# Altium project mod_x_cb.PrjPCB
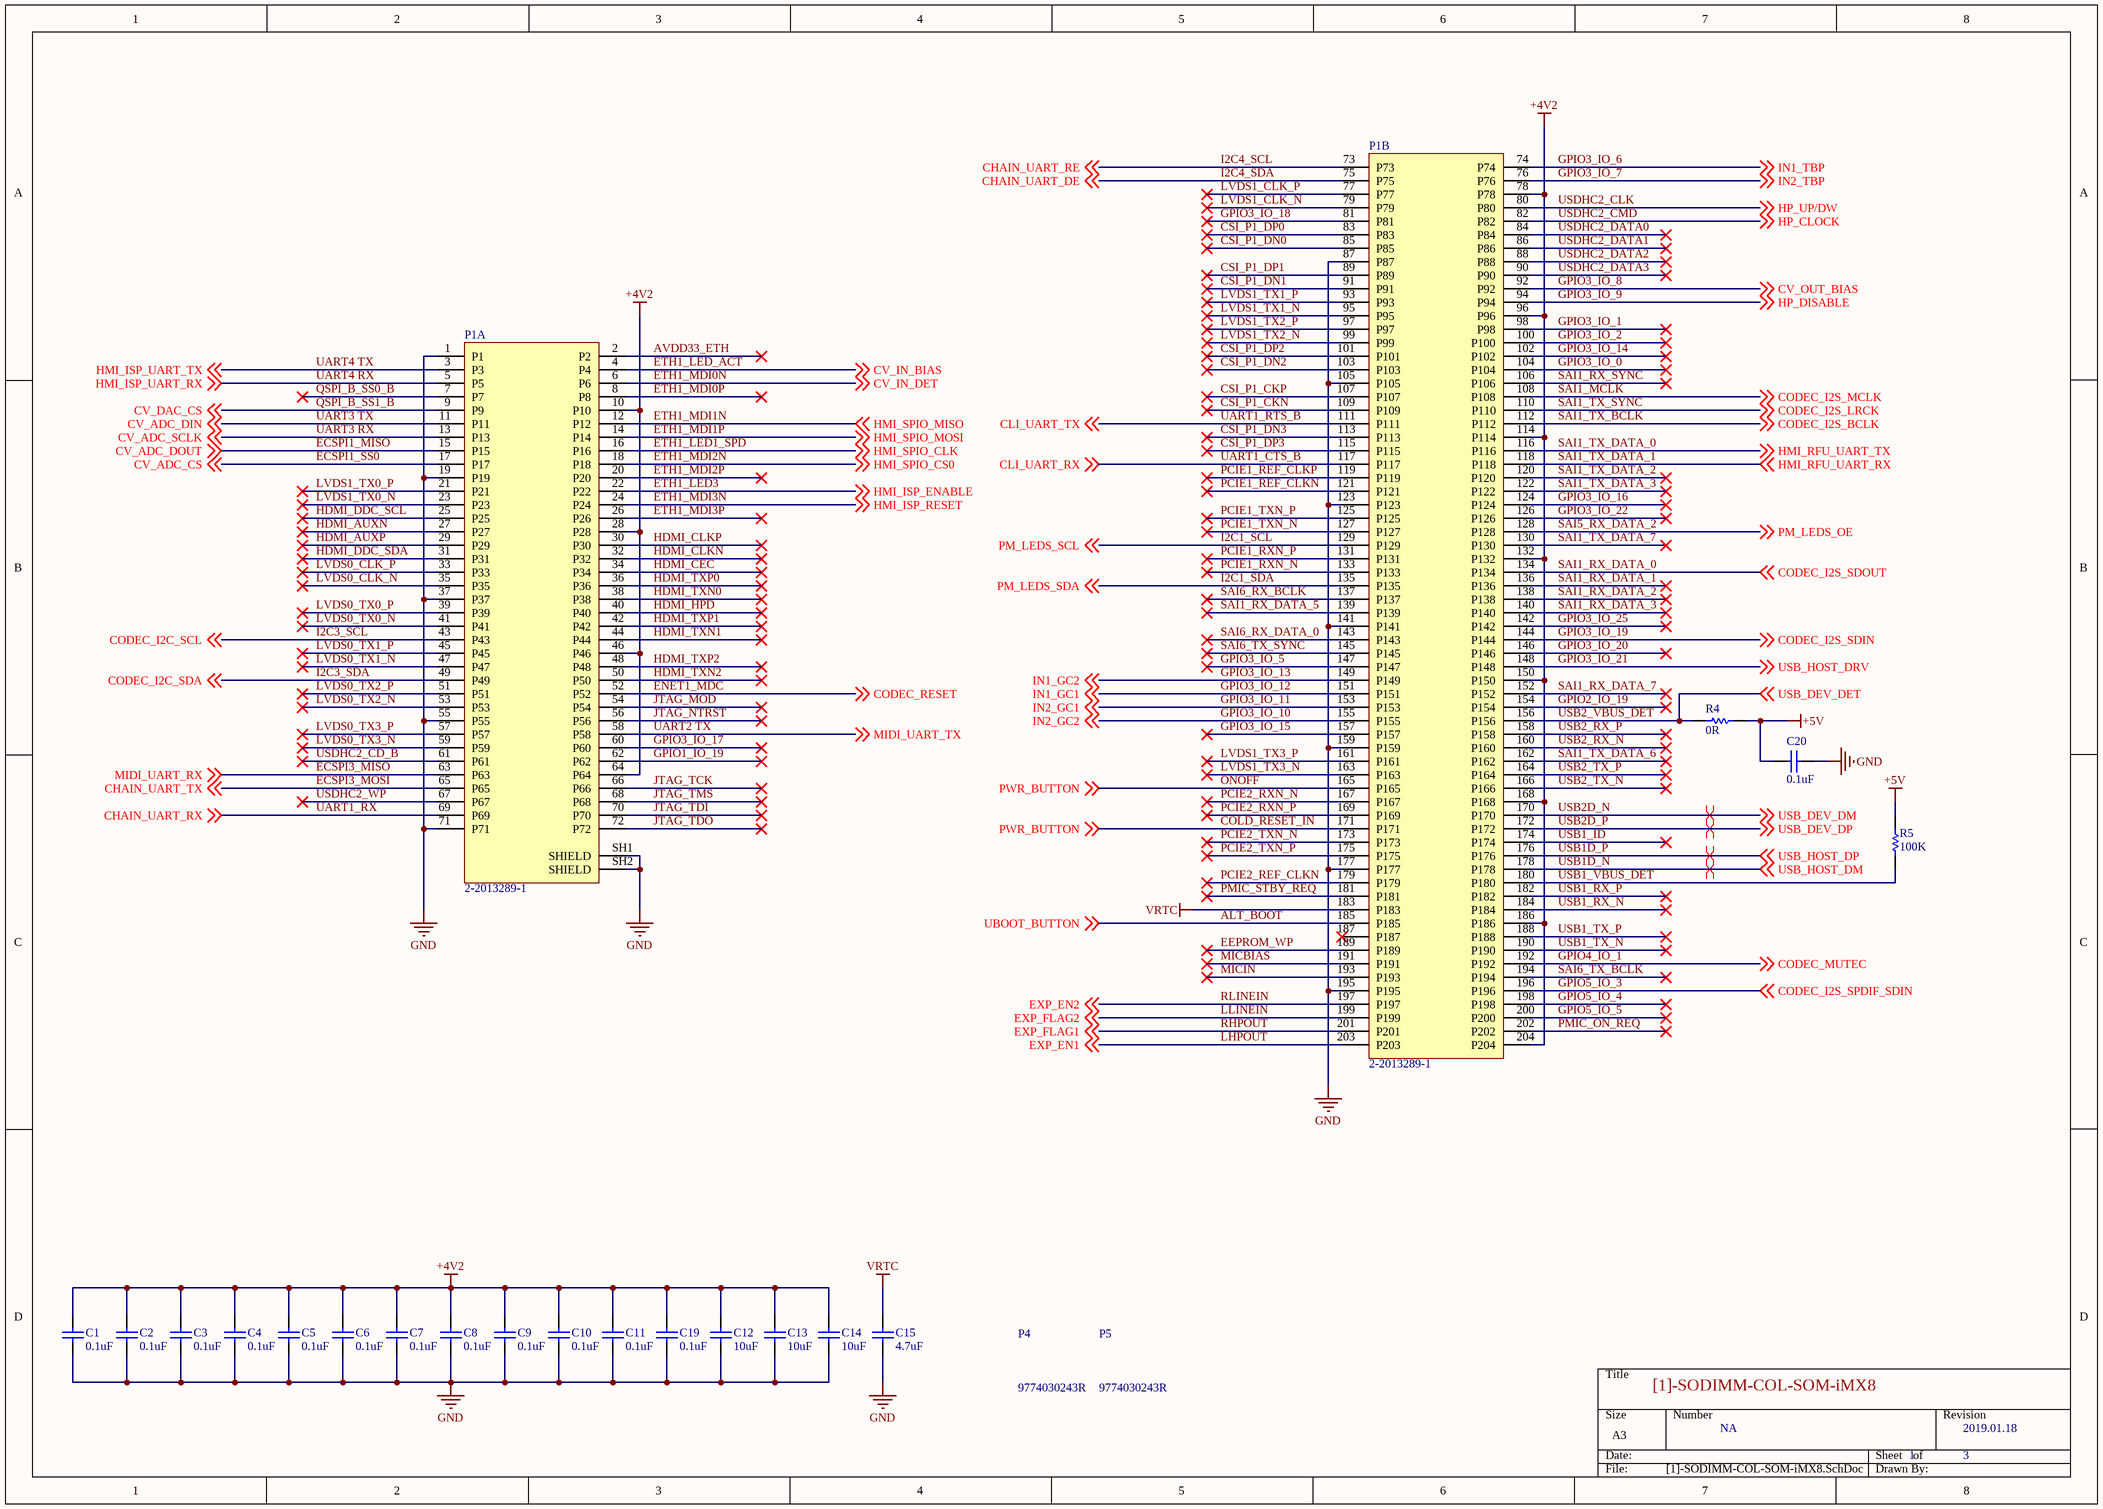
[diagram p0: [1]-SODIMM-COL-SOM-iMX8.SchDoc]
3 sheets, 33 parts. Net scope: global (net labels, ports and power ports of the same name join across sheets).
Board file: mod_duo_x_cb.PcbDoc
Sheets:
  [1]-SODIMM-COL-SOM-iMX8.SchDoc
  [2]-INTERFACE_CONNS.SchDoc
  [3]-DCDC-4V2.SchDoc

## Sheet [1]-SODIMM-COL-SOM-iMX8.SchDoc: [1]-SODIMM-COL-SOM-iMX8
size A3; DocumentNumber: NA; Revision: 2019.01.18; SheetNumber: 1; SheetTotal: 3

### Parts
C1  0.1uF  [CAPC1005N]
C2  0.1uF  [CAPC1005N]
C3  0.1uF  [CAPC1005N]
C4  0.1uF  [CAPC1005N]
C5  0.1uF  [CAPC1005N]
C6  0.1uF  [CAPC1005N]
C7  0.1uF  [CAPC1005N]
C8  0.1uF  [CAPC1005N]
C9  0.1uF  [CAPC1005N]
C10  0.1uF  [CAPC1005N]
C11  0.1uF  [CAPC1005N]
C12  10uF  [CAPC2012N]
C13  10uF  [CAPC2012N]
C14  10uF  [CAPC2012N]
C15  4.7uF  [CAPC1608N]
C19  0.1uF  [CAPC1005N]
C20  0.1uF  [CAPC1005N]
P1  2-2013289-1  [TE_2-2013289-1]  (parts A,B of 2)
P4  9774030243R  [9774030243R]
P5  9774030243R  [9774030243R]
R4  0R  [RESC1608N]
R5  100K  [RESC1005N]

### Nets
+4V2: C1.2 C2.2 C3.2 C4.2 C5.2 C6.2 C7.2 C8.2 C9.2 C10.2 C11.2 C12.2 C13.2 C14.2 C19.2 P1.10(P10) P1.28(P28) P1.46(P46) P1.64(P64) P1.78(P78) P1.96(P96) P1.114(P114) P1.132(P132) P1.150(P150) P1.168(P168) P1.186(P186) P1.204(P204)
+5V: C20.2 R4.2 R5.2
GND: C1.1 C2.1 C3.1 C4.1 C5.1 C6.1 C7.1 C8.1 C9.1 C10.1 C11.1 C12.1 C13.1 C14.1 C15.1 C19.1 C20.1 P1.1(P1) P1.19(P19) P1.37(P37) P1.55(P55) P1.71(P71) P1.87(P87) P1.105(P105) P1.123(P123) P1.141(P141) P1.159(P159) P1.177(P177) P1.195(P195) P1.SH1(SHIELD) P1.SH2(SHIELD)
VRTC: C15.2 P1.183(P183)
ALT_BOOT: P1.185(P185) ; off-sheet UBOOT_BUTTON  [also labelled UBOOT_BUTTON]
AVDD33_ETH: P1.2(P2)
CHAIN_UART_DE: P1.75(P75) ; off-sheet CHAIN_UART_DE  [also labelled I2C4_SDA]
CHAIN_UART_RE: P1.73(P73) ; off-sheet CHAIN_UART_RE  [also labelled I2C4_SCL]
CHAIN_UART_RX: P1.69(P69) ; off-sheet CHAIN_UART_RX  [also labelled UART1_RX]
CHAIN_UART_TX: P1.65(P65) ; off-sheet CHAIN_UART_TX  [also labelled ECSPI3_MOSI]
CLI_UART_RX: P1.117(P117) ; off-sheet CLI_UART_RX  [also labelled UART1_CTS_B]
CLI_UART_TX: P1.111(P111) ; off-sheet CLI_UART_TX  [also labelled UART1_RTS_B]
CODEC_I2C_SCL: P1.43(P43) ; off-sheet CODEC_I2C_SCL  [also labelled I2C3_SCL]
CODEC_I2C_SDA: P1.49(P49) ; off-sheet CODEC_I2C_SDA  [also labelled I2C3_SDA]
CODEC_I2S_BCLK: P1.112(P112) ; off-sheet CODEC_I2S_BCLK  [also labelled SAI1_TX_BCLK]
CODEC_I2S_LRCK: P1.110(P110) ; off-sheet CODEC_I2S_LRCK  [also labelled SAI1_TX_SYNC]
CODEC_I2S_MCLK: P1.108(P108) ; off-sheet CODEC_I2S_MCLK  [also labelled SAI1_MCLK]
CODEC_I2S_SDIN: P1.144(P144) ; off-sheet CODEC_I2S_SDIN  [also labelled GPIO3_IO_19]
CODEC_I2S_SDOUT: P1.134(P134) ; off-sheet CODEC_I2S_SDOUT  [also labelled SAI1_RX_DATA_0]
CODEC_I2S_SPDIF_SDIN: P1.196(P196) ; off-sheet CODEC_I2S_SPDIF_SDIN  [also labelled GPIO5_IO_3]
CODEC_MUTEC: P1.192(P192) ; off-sheet CODEC_MUTEC  [also labelled GPIO4_IO_1]
CODEC_RESET: P1.52(P52) ; off-sheet CODEC_RESET  [also labelled ENET1_MDC]
COLD_RESET_IN: P1.165(P165) P1.171(P171) ; off-sheet PWR_BUTTON  [also labelled ONOFF, PWR_BUTTON]
CSI_P1_CKN: P1.109(P109)
CSI_P1_CKP: P1.107(P107)
CSI_P1_DN0: P1.85(P85)
CSI_P1_DN1: P1.91(P91)
CSI_P1_DN2: P1.103(P103)
CSI_P1_DN3: P1.113(P113)
CSI_P1_DP0: P1.83(P83)
CSI_P1_DP1: P1.89(P89)
CSI_P1_DP2: P1.101(P101)
CSI_P1_DP3: P1.115(P115)
CV_ADC_CS: P1.17(P17) ; off-sheet CV_ADC_CS  [also labelled ECSPI1_SS0]
CV_ADC_DIN: P1.11(P11) ; off-sheet CV_ADC_DIN  [also labelled UART3 TX]
CV_ADC_DOUT: P1.15(P15) ; off-sheet CV_ADC_DOUT  [also labelled ECSPI1_MISO]
CV_ADC_SCLK: P1.13(P13) ; off-sheet CV_ADC_SCLK  [also labelled UART3 RX]
CV_DAC_CS: P1.9(P9) ; off-sheet CV_DAC_CS  [also labelled QSPI_B_SS1_B]
CV_IN_BIAS: P1.4(P4) ; off-sheet CV_IN_BIAS  [also labelled ETH1_LED_ACT]
CV_IN_DET: P1.6(P6) ; off-sheet CV_IN_DET  [also labelled ETH1_MDI0N]
CV_OUT_BIAS: P1.92(P92) ; off-sheet CV_OUT_BIAS  [also labelled GPIO3_IO_8]
ECSPI3_MISO: P1.63(P63) ; off-sheet MIDI_UART_RX  [also labelled MIDI_UART_RX]
EEPROM_WP: P1.189(P189)
ETH1_LED1_SPD: P1.16(P16) ; off-sheet HMI_SPIO_CLK  [also labelled HMI_SPIO_CLK]
ETH1_LED3: P1.22(P22) ; off-sheet HMI_ISP_ENABLE  [also labelled HMI_ISP_ENABLE]
ETH1_MDI0P: P1.8(P8)
ETH1_MDI1N: P1.12(P12) ; off-sheet HMI_SPIO_MISO  [also labelled HMI_SPIO_MISO]
ETH1_MDI1P: P1.14(P14) ; off-sheet HMI_SPIO_MOSI  [also labelled HMI_SPIO_MOSI]
ETH1_MDI2N: P1.18(P18) ; off-sheet HMI_SPIO_CS0  [also labelled HMI_SPIO_CS0]
ETH1_MDI2P: P1.20(P20)
ETH1_MDI3N: P1.24(P24) ; off-sheet HMI_ISP_RESET  [also labelled HMI_ISP_RESET]
ETH1_MDI3P: P1.26(P26)
EXP_EN1: P1.203(P203) ; off-sheet EXP_EN1  [also labelled LHPOUT]
EXP_EN2: P1.197(P197) ; off-sheet EXP_EN2  [also labelled RLINEIN]
EXP_FLAG1: P1.201(P201) ; off-sheet EXP_FLAG1  [also labelled RHPOUT]
EXP_FLAG2: P1.199(P199) ; off-sheet EXP_FLAG2  [also labelled LLINEIN]
GPIO1_IO_19: P1.62(P62)
GPIO2_IO_19: P1.154(P154)
GPIO3_IO_0: P1.104(P104)
GPIO3_IO_1: P1.98(P98)
GPIO3_IO_2: P1.100(P100)
GPIO3_IO_5: P1.147(P147)
GPIO3_IO_6: P1.74(P74) ; off-sheet IN1_TBP  [also labelled IN1_TBP]
GPIO3_IO_7: P1.76(P76) ; off-sheet IN2_TBP  [also labelled IN2_TBP]
GPIO3_IO_9: P1.94(P94) ; off-sheet HP_DISABLE  [also labelled HP_DISABLE]
GPIO3_IO_10: P1.155(P155) ; off-sheet IN2_GC2  [also labelled IN2_GC2]
GPIO3_IO_11: P1.153(P153) ; off-sheet IN2_GC1  [also labelled IN2_GC1]
GPIO3_IO_12: P1.151(P151) ; off-sheet IN1_GC1  [also labelled IN1_GC1]
GPIO3_IO_13: P1.149(P149) ; off-sheet IN1_GC2  [also labelled IN1_GC2]
GPIO3_IO_14: P1.102(P102)
GPIO3_IO_15: P1.157(P157)
GPIO3_IO_16: P1.124(P124)
GPIO3_IO_17: P1.60(P60)
GPIO3_IO_18: P1.81(P81)
GPIO3_IO_20: P1.146(P146)
GPIO3_IO_21: P1.148(P148) ; off-sheet USB_HOST_DRV  [also labelled USB_HOST_DRV]
GPIO3_IO_22: P1.126(P126)
GPIO3_IO_25: P1.142(P142)
GPIO5_IO_4: P1.198(P198)
GPIO5_IO_5: P1.200(P200)
HDMI_AUXN: P1.27(P27)
HDMI_AUXP: P1.29(P29)
HDMI_CEC: P1.34(P34)
HDMI_CLKN: P1.32(P32)
HDMI_CLKP: P1.30(P30)
HDMI_DDC_SCL: P1.25(P25)
HDMI_DDC_SDA: P1.31(P31)
HDMI_HPD: P1.40(P40)
HDMI_TXN0: P1.38(P38)
HDMI_TXN1: P1.44(P44)
HDMI_TXN2: P1.50(P50)
HDMI_TXP0: P1.36(P36)
HDMI_TXP1: P1.42(P42)
HDMI_TXP2: P1.48(P48)
HMI_ISP_UART_RX: P1.5(P5) ; off-sheet HMI_ISP_UART_RX  [also labelled UART4 RX]
HMI_ISP_UART_TX: P1.3(P3) ; off-sheet HMI_ISP_UART_TX  [also labelled UART4 TX]
HMI_RFU_UART_RX: P1.118(P118) ; off-sheet HMI_RFU_UART_RX  [also labelled SAI1_TX_DATA_1]
HMI_RFU_UART_TX: P1.116(P116) ; off-sheet HMI_RFU_UART_TX  [also labelled SAI1_TX_DATA_0]
HP_CLOCK: P1.82(P82) ; off-sheet HP_CLOCK  [also labelled USDHC2_CMD]
HP_UP/DW: P1.80(P80) ; off-sheet HP_UP/DW  [also labelled USDHC2_CLK]
I2C1_SCL: P1.129(P129) ; off-sheet PM_LEDS_SCL  [also labelled PM_LEDS_SCL]
I2C1_SDA: P1.135(P135) ; off-sheet PM_LEDS_SDA  [also labelled PM_LEDS_SDA]
JTAG_MOD: P1.54(P54)
JTAG_NTRST: P1.56(P56)
JTAG_TCK: P1.66(P66)
JTAG_TDI: P1.70(P70)
JTAG_TDO: P1.72(P72)
JTAG_TMS: P1.68(P68)
LVDS0_CLK_N: P1.35(P35)
LVDS0_CLK_P: P1.33(P33)
LVDS0_TX0_N: P1.41(P41)
LVDS0_TX0_P: P1.39(P39)
LVDS0_TX1_N: P1.47(P47)
LVDS0_TX1_P: P1.45(P45)
LVDS0_TX2_N: P1.53(P53)
LVDS0_TX2_P: P1.51(P51)
LVDS0_TX3_N: P1.59(P59)
LVDS0_TX3_P: P1.57(P57)
LVDS1_CLK_N: P1.79(P79)
LVDS1_CLK_P: P1.77(P77)
LVDS1_TX0_N: P1.23(P23)
LVDS1_TX0_P: P1.21(P21)
LVDS1_TX1_N: P1.95(P95)
LVDS1_TX1_P: P1.93(P93)
LVDS1_TX2_N: P1.99(P99)
LVDS1_TX2_P: P1.97(P97)
LVDS1_TX3_N: P1.163(P163)
LVDS1_TX3_P: P1.161(P161)
MICBIAS: P1.191(P191)
MICIN: P1.193(P193)
MIDI_UART_TX: P1.58(P58) ; off-sheet MIDI_UART_TX  [also labelled UART2 TX]
PCIE1_REF_CLKN: P1.121(P121)
PCIE1_REF_CLKP: P1.119(P119)
PCIE1_RXN_N: P1.133(P133)
PCIE1_RXN_P: P1.131(P131)
PCIE1_TXN_N: P1.127(P127)
PCIE1_TXN_P: P1.125(P125)
PCIE2_REF_CLKN: P1.179(P179)
PCIE2_RXN_N: P1.167(P167)
PCIE2_RXN_P: P1.169(P169)
PCIE2_TXN_N: P1.173(P173)
PCIE2_TXN_P: P1.175(P175)
PM_LEDS_OE: P1.128(P128) ; off-sheet PM_LEDS_OE  [also labelled SAI5_RX_DATA_2]
PMIC_ON_REQ: P1.202(P202)
PMIC_STBY_REQ: P1.181(P181)
QSPI_B_SS0_B: P1.7(P7)
SAI1_RX_DATA_1: P1.136(P136)
SAI1_RX_DATA_2: P1.138(P138)
SAI1_RX_DATA_3: P1.140(P140)
SAI1_RX_DATA_5: P1.139(P139)
SAI1_RX_DATA_7: P1.152(P152)
SAI1_RX_SYNC: P1.106(P106)
SAI1_TX_DATA_2: P1.120(P120)
SAI1_TX_DATA_3: P1.122(P122)
SAI1_TX_DATA_6: P1.162(P162)
SAI1_TX_DATA_7: P1.130(P130)
SAI6_RX_BCLK: P1.137(P137)
SAI6_RX_DATA_0: P1.143(P143)
SAI6_TX_BCLK: P1.194(P194)
SAI6_TX_SYNC: P1.145(P145)
USB1_ID: P1.174(P174)
USB1_RX_N: P1.184(P184)
USB1_RX_P: P1.182(P182)
USB1_TX_N: P1.190(P190)
USB1_TX_P: P1.188(P188)
USB1_VBUS_DET: P1.180(P180) R5.1
USB1D_N: P1.178(P178) ; off-sheet USB_HOST_DM  [also labelled USB_HOST_DM]
USB1D_P: P1.176(P176) ; off-sheet USB_HOST_DP  [also labelled USB_HOST_DP]
USB2_RX_N: P1.160(P160)
USB2_RX_P: P1.158(P158)
USB2_TX_N: P1.166(P166)
USB2_TX_P: P1.164(P164)
USB2_VBUS_DET: P1.156(P156) R4.1 ; off-sheet USB_DEV_DET  [also labelled USB_DEV_DET]
USB2D_N: P1.170(P170) ; off-sheet USB_DEV_DM  [also labelled USB_DEV_DM]
USB2D_P: P1.172(P172) ; off-sheet USB_DEV_DP  [also labelled USB_DEV_DP]
USDHC2_CD_B: P1.61(P61)
USDHC2_DATA0: P1.84(P84)
USDHC2_DATA1: P1.86(P86)
USDHC2_DATA2: P1.88(P88)
USDHC2_DATA3: P1.90(P90)
USDHC2_WP: P1.67(P67)

Not connected (* = marked no-connect by the designer): P1 187(P187)*

### Layout directives
differential pair: USB1D_N, USB1D_P, USB2D_N, USB2D_P

### Library data of the parts
C1-C11 C19 C20 = GRM155R71H104KE14D: CAP CER 0.1UF 50V X7R 0402; Manufacturer 1: Murata; Description 1: Cap Ceramic 0.1uF 50V X7R 10% SMD 0402 125C Paper T/R; Voltage Rating DC: 50 VDC; Tolerance: 10 %; Brand: Murata Electronics; Capacitance - nF: 100 nF; Capacitance - pF: 100000 pF; Class: Class 2; Type: General Purpose Ceramic Capacitors; Unit Weight: 0.000212 oz; Supplier 1: Digi-Key; Manufacturer Part Number 1: GRM155R71H104KE14D; Stock 1: 0; Pricing 1: 1=0.1, 10=0.022, 100=0.0099, 500=0.0071, 1000=0.0056, 2500=0.0051, 5000=0.0047 (USD); Product Category: Multilayer Ceramic Capacitors MLCC - SMD/SMT; RoHS: True; Capacitance: 0.1 uF; Dielectric: X7R; Case Code - in: 0402; Case Code - mm: 1005; Height: 0.5 mm; Maximum Operating Temperature: + 125 C; Minimum Operating Temperature: - 55 C; Product: General Type MLCCs; Series: GRM; Packaging: Reel; Length: 1 mm; Package / Case: 0402 (1005 metric); Factory Pack Quantity: 10000; Termination Style: SMD/SMT; Width: 0.5 mm; ComponentLink1URL: http://components.arrow.com/part/dataview/0323_07030614; ComponentLink1Description: http://components.arrow.com/part/dataview/0323_07030614; ComponentLink2URL: http://psearch.en.murata.com/capacitor/product/GRM155R71H104KE14%23.pdf; ComponentLink2Description: http://psearch.en.murata.com/capacitor/product/GRM155R71H104KE14%23.pdf; ComponentLink3URL: http://www.mouser.com/ds/2/281/c02e-2905.pdf; ComponentLink3Description: http://www.mouser.com/ds/2/281/c02e-2905.pdf; ComponentLink4URL: http://search.murata.co.jp/Ceramy/image/img/A01X/partnumbering_e_01.pdf; ComponentLink4Description: http://search.murata.co.jp/Ceramy/image/img/A01X/partnumbering_e_01.pdf; ComponentLink5URL: http://www.farnell.com/datasheets/2079156.pdf; ComponentLink5Description: http://www.farnell.com/datasheets/2079156.pdf; Supplier Part Number 1: 490-10700-1-ND
C12-C14 = C2012X7R1A106K125AC: CAP CER 10UF 10V X7R 0805; Manufacturer 1: TDK; Dielectric Material: Ceramic; Tolerance: 10%; Supplier 1: Digi-Key; Manufacturer Part Number 1: C2012X7R1A106K125AC; Stock 1: 20000; Pricing 1: 1=0.52, 10=0.359, 100=0.2156, 500=0.16172, 1000=0.13656 (USD); Mount: Surface Mount; Case/Package: 0805; Number of Pins: 2; Weight: 0.000194oz; Case Code (Metric): 2012; Case Code (Imperial): 0805; Contact Plating: Matte,Tin; Min Operating Temperature: -55°C; Max Operating Temperature: 125°C; Capacitance: 10uF; Dielectric: X7R; Voltage Rating: 10V; Packaging: Tape and Reel; Voltage Rating (DC): 10V; Termination: SMD/SMT; Package Quantity: 1; Composition: Ceramic; Voltage: 10V; Length: 2mm; Height: 1.25mm; Width: 0.049inch; Depth: 1.25mm; Thickness: 0.057inch; Radiation Hardening: No; Lead Free: Lead Free; REACH SVHC: No SVHC; Supplier Part Number 1: 445-6857-1-ND
C15 = LMK107BJ475KAHT: CAP CER 4.7UF 10V X5R 0603; Manufacturer 1: Taiyo Yuden; Tolerance: 10%; Supplier 1: Digi-Key; Manufacturer Part Number 1: LMK107BJ475KAHT; Stock 1: 148910; Pricing 1: 1=0.24, 10=0.166, 100=0.0839, 500=0.0574, 1000=0.0508 (USD); Mount: Surface Mount; Case/Package: 0603; Case Code (Metric): 1608; Case Code (Imperial): 0603; Min Operating Temperature: -55°C; Max Operating Temperature: 85°C; Capacitance: 4.7uF; Dielectric: X5R; Termination: SMD/SMT; Voltage Rating (DC): 10V; Packaging: Tape and Reel; Package Quantity: 4000; Voltage Rating: 10V; Length: 0.063inch; Height: 0.8mm; Width: 0.031inch; Thickness: 0.035inch; Lead Free: Lead Free; Halogen Free: Halogen Free; ComponentLink1URL: https://datasheet.ciiva.com/18697/mlcc01-hq-e-18697513.pdf; ComponentLink1Description: https://datasheet.ciiva.com/18697/mlcc01-hq-e-18697513.pdf; ComponentLink2URL: https://datasheet.ciiva.com/18697/mlcc01-hq-e-18697514.pdf; ComponentLink2Description: https://datasheet.ciiva.com/18697/mlcc01-hq-e-18697514.pdf; ComponentLink3URL: https://datasheet.ciiva.com/18697/mlcc01-hq-e-18697515.pdf; ComponentLink3Description: https://datasheet.ciiva.com/18697/mlcc01-hq-e-18697515.pdf; Supplier Part Number 1: 587-3416-1-ND
P1 = 2-2013289-1: CONN SKT SODIMM 204POS SMD; Manufacturer 1: TE Connectivity; Body Material: Thermoplastic; Number of Contacts: 204; Memory Type: DDR,SDRAM; Gender: Female; PCB Mount Retention: With; Circuit Application: Power; Connector System: Cable-to-Board; Sealable: No (Without); Voltage Rating: 1.5V; Contact Current Rating: 500mA; Pitch: 0.024inch; Row Spacing: 0.322inch; Stack Height: 5.2mm; Supplier 1: Digi-Key; Manufacturer Part Number 1: 2-2013289-1; Stock 1: 1312; Pricing 1: 1=4.89, 10=4.688, 25=4.2808, 50=4.0768, 100=3.873 (USD); Mount: Surface Mount; Contact Material: Copper Alloy; Contact Plating: Gold; Housing Material: Thermoplastic; Housing Colour: Black; Insulation Material: Thermoplastic; Min Operating Temperature: -67°C; Max Operating Temperature: 185°C; Number of Rows: 2; Termination: Solder; Orientation: Right Angle; Package Quantity: 200; Packaging: Tape and Reel; Number of Positions: 204; Length: 71.5mm; Height: 5.2mm; Depth: 26.5mm; Radiation Hardening: No; Flammability Rating: UL94 V-0; Supplier Part Number 1: A116236CT-ND
P4 P5 = 9774030243R: ROUND STANDOFF M2X0.4 STEEL 3MM; Manufacturer 1: Wurth Electronics; Plating: Tin; Threaded/Unthreaded: Threaded; Outside Diameter: 0.171inch; Supplier 1: Digi-Key; Manufacturer Part Number 1: 9774030243R; Stock 1: 12955; Pricing 1: 1=0.95, 10=0.918, 50=0.795, 100=0.739 (USD); Material: Steel; Length: 0.173inch; REACH SVHC: Unknown; Supplier Part Number 1: 732-7085-1-ND
R4 = ERJ-3GEY0R00V: RES SMD 0 OHM JUMPER 1/10W 0603; Manufacturer: Panasonic; Resistance: 0mR; Power Rating: 100mW; Voltage Rating: 75V; Tolerance: 0%; Temperature Coefficient: 600ppm/°C; Voltage Rating (DC): 50V; Supplier 1: Digi-Key; Manufacturer Part Number: ERJ-3GEY0R00V; Stock 1: 17095467; Pricing 1: 1=0.1, 10=0.053, 25=0.038, 50=0.029, 100=0.0214, 250=0.01632, 500=0.01306, 1000=0.00962 (USD); Mount: Surface Mount; Case/Package: 0603; Contact Plating: Tin; Case Code (Metric): 1608; Case Code (Imperial): 0603; Min Operating Temperature: -55°C; Max Operating Temperature: 155°C; Composition: Thick Film; Packaging: Tape and Reel; Package Quantity: 1; Number of Terminations: 2; Termination: SMD/SMT; Military Standard: Not; Max Power Dissipation: 100mW; Features: Automotive AEC-Q200; Length: 1.6mm; Height: 0.45mm; Width: 0.031inch; Depth: 0.8mm; Radiation Hardening: No; REACH SVHC: No SVHC; Lead Free: Lead Free; ComponentLink1URL: https://datasheet.ciiva.com/27055/1935748-27055113.pdf; ComponentLink1Description: https://datasheet.ciiva.com/27055/1935748-27055113.pdf; ComponentLink2URL: https://datasheet.ciiva.com/11808/0900766b80f806dd-11808207.pdf; ComponentLink2Description: https://datasheet.ciiva.com/11808/0900766b80f806dd-11808207.pdf; ComponentLink3URL: https://datasheet.ciiva.com/48532/aoa0000ce1-48532165.pdf; ComponentLink3Description: https://datasheet.ciiva.com/48532/aoa0000ce1-48532165.pdf; ComponentLink4URL: https://datasheet.ciiva.com/43460/1678796-43460647.pdf; ComponentLink4Description: https://datasheet.ciiva.com/43460/1678796-43460647.pdf; ComponentLink5URL: https://datasheet.ciiva.com/28695/1678796-28695833.pdf; ComponentLink5Description: https://datasheet.ciiva.com/28695/1678796-28695833.pdf; ComponentLink6URL: https://datasheet.ciiva.com/5959/1678796-5959707.pdf; ComponentLink6Description: https://datasheet.ciiva.com/5959/1678796-5959707.pdf; ComponentLink7URL: https://datasheet.ciiva.com/16834/aoa0000ce1-16834828.pdf; ComponentLink7Description: https://datasheet.ciiva.com/16834/aoa0000ce1-16834828.pdf; ComponentLink8URL: https://datasheet.ciiva.com/17215/aoa0000ce1-17215388.pdf; ComponentLink8Description: https://datasheet.ciiva.com/17215/aoa0000ce1-17215388.pdf; ComponentLink9URL: https://datasheet.ciiva.com/46377/1678796-46377868.pdf; ComponentLink9Description: https://datasheet.ciiva.com/46377/1678796-46377868.pdf; ComponentLink10URL: https://datasheet.ciiva.com/30199/4aoa0000ce1-30199822.pdf; ComponentLink10Description: https://datasheet.ciiva.com/30199/4aoa0000ce1-30199822.pdf; ComponentLink11URL: https://datasheet.ciiva.com/9198/aoa0000ce1-9198975.pdf; ComponentLink11Description: https://datasheet.ciiva.com/9198/aoa0000ce1-9198975.pdf; ComponentLink12URL: https://datasheet.ciiva.com/16758/70255313-16758527.pdf; ComponentLink12Description: https://datasheet.ciiva.com/16758/70255313-16758527.pdf; Supplier Part Number 1: P0.0GCT-ND
R5 = RC0402FR-07100KL: RES SMD 100K OHM 1% 1/16W 0402; Manufacturer 1: Yageo; Resistance: 100 kOhms; Power Rating: 62.5 mW (1/16 W); Voltage Rating: 50 V; Temperature Coefficient: 100 PPM / C; Supplier 1: Digi-Key; Manufacturer Part Number 1: RC0402FR-07100KL; Description 1: RES SMD 100K OHM 1% 1/16W 0402; Stock 1: 10691398; Pricing 1: 1=0.1, 10=0.014, 100=0.0056, 1000=0.0025, 2500=0.0022, 5000=0.0018 (USD); Termination Style: SMD/SMT; Product: Thick Film Resistors General Purpose; Tolerance: 1 %; Case Code - in: 0402; Case Code - mm: 1005; Series: RC; Operating Temperature Range: - 55 C to + 155 C; Packaging: Reel; ComponentLink1URL: https://datasheet.ciiva.com/11819/0900766b80c66297-11819452.pdf; ComponentLink1Description: https://datasheet.ciiva.com/11819/0900766b80c66297-11819452.pdf; ComponentLink2URL: https://datasheet.ciiva.com/16740/pyu-rc0402-51-rohs-l-6-r-16740567.pdf; ComponentLink2Description: https://datasheet.ciiva.com/16740/pyu-rc0402-51-rohs-l-6-r-16740567.pdf; ComponentLink3URL: https://datasheet.ciiva.com/12667/pyu-rc0402-51-rohs-l-6-r-12667930.pdf; ComponentLink3Description: https://datasheet.ciiva.com/12667/pyu-rc0402-51-rohs-l-6-r-12667930.pdf; ComponentLink4URL: https://datasheet.ciiva.com/2453/pyu-r-int-thick-7-2453361.pdf; ComponentLink4Description: https://datasheet.ciiva.com/2453/pyu-r-int-thick-7-2453361.pdf; ComponentLink5URL: https://datasheet.ciiva.com/15189/getdatasheetpartid-323696-15189334.pdf; ComponentLink5Description: https://datasheet.ciiva.com/15189/getdatasheetpartid-323696-15189334.pdf; ComponentLink6URL: https://datasheet.ciiva.com/2453/pyu-r-int-thick-7-2453362.pdf; ComponentLink6Description: https://datasheet.ciiva.com/2453/pyu-r-int-thick-7-2453362.pdf; ComponentLink7URL: https://datasheet.ciiva.com/2453/pyu-r-int-thick-7-2453363.pdf; ComponentLink7Description: https://datasheet.ciiva.com/2453/pyu-r-int-thick-7-2453363.pdf; ComponentLink8URL: https://datasheet.ciiva.com/22747/1018594-22747509.pdf; ComponentLink8Description: https://datasheet.ciiva.com/22747/1018594-22747509.pdf; Supplier Part Number 1: 311-100KLRCT-ND

## Sheet [2]-INTERFACE_CONNS.SchDoc: [2]-INTERFACE_CONNS
size A3; DocumentNumber: NA; Revision: 2019.01.18; SheetNumber: 2; SheetTotal: 3
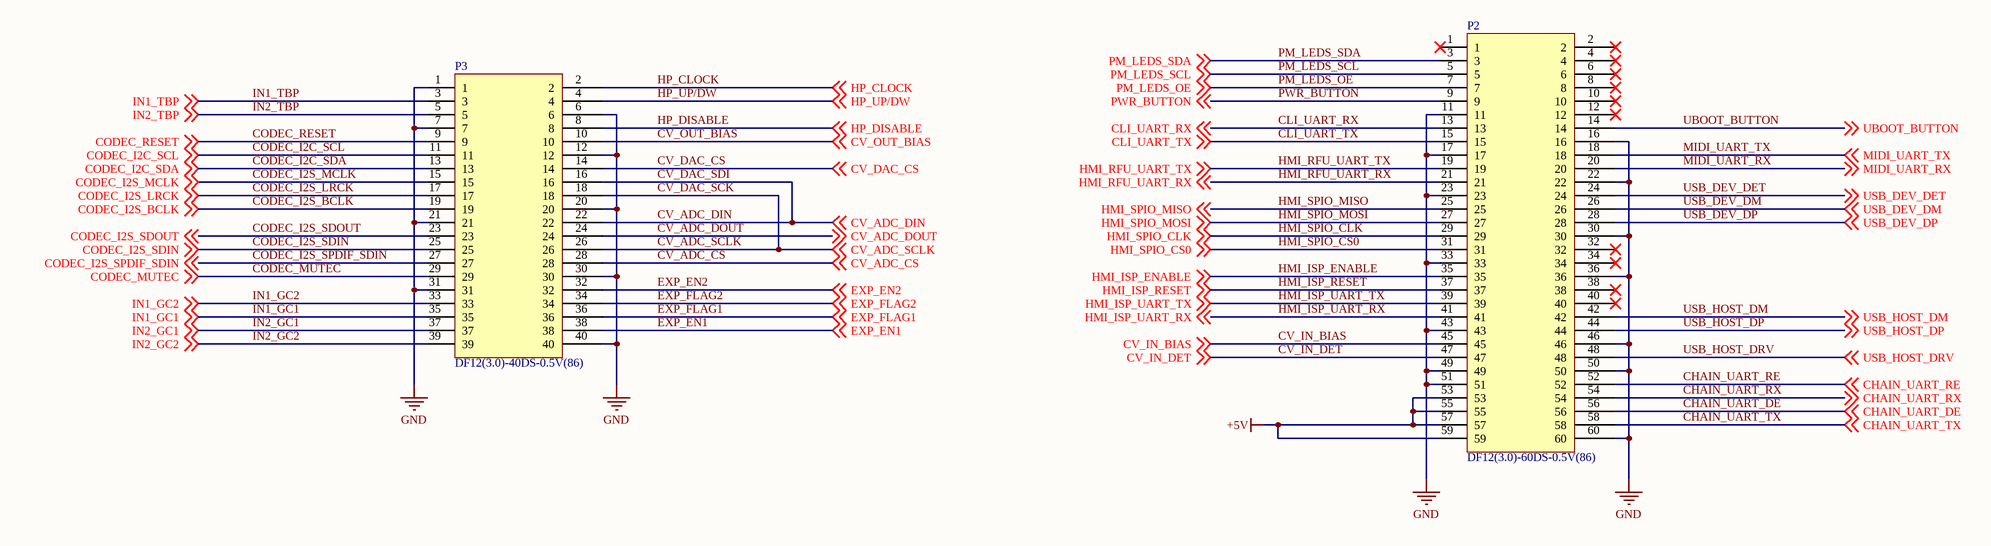
[diagram p1: [2]-INTERFACE_CONNS.SchDoc]

### Parts
P2  DF12(3.0)-60DS-0.5V(86)  [DF12-60]
P3  DF12(3.0)-40DS-0.5V(86)  [DF12-40]

### Nets
+5V: P2.53 P2.55 P2.57 P2.59
GND: P2.11 P2.16 P2.17 P2.22 P2.23 P2.30 P2.33 P2.36 P2.43 P2.46 P2.49 P2.50 P2.51 P2.60 P3.1 P3.6 P3.7 P3.12 P3.20 P3.21 P3.30 P3.31 P3.40
CHAIN_UART_DE: P2.56 ; off-sheet CHAIN_UART_DE
CHAIN_UART_RE: P2.52 ; off-sheet CHAIN_UART_RE
CHAIN_UART_RX: P2.54 ; off-sheet CHAIN_UART_RX
CHAIN_UART_TX: P2.58 ; off-sheet CHAIN_UART_TX
CLI_UART_RX: P2.13 ; off-sheet CLI_UART_RX
CLI_UART_TX: P2.15 ; off-sheet CLI_UART_TX
CODEC_I2C_SCL: P3.11 ; off-sheet CODEC_I2C_SCL
CODEC_I2C_SDA: P3.13 ; off-sheet CODEC_I2C_SDA
CODEC_I2S_BCLK: P3.19 ; off-sheet CODEC_I2S_BCLK
CODEC_I2S_LRCK: P3.17 ; off-sheet CODEC_I2S_LRCK
CODEC_I2S_MCLK: P3.15 ; off-sheet CODEC_I2S_MCLK
CODEC_I2S_SDIN: P3.25 ; off-sheet CODEC_I2S_SDIN
CODEC_I2S_SDOUT: P3.23 ; off-sheet CODEC_I2S_SDOUT
CODEC_I2S_SPDIF_SDIN: P3.27 ; off-sheet CODEC_I2S_SPDIF_SDIN
CODEC_MUTEC: P3.29 ; off-sheet CODEC_MUTEC
CODEC_RESET: P3.9 ; off-sheet CODEC_RESET
CV_ADC_CS: P3.28 ; off-sheet CV_ADC_CS
CV_ADC_DIN: P3.16 P3.22 ; off-sheet CV_ADC_DIN  [also labelled CV_DAC_SDI]
CV_ADC_DOUT: P3.24 ; off-sheet CV_ADC_DOUT
CV_ADC_SCLK: P3.18 P3.26 ; off-sheet CV_ADC_SCLK  [also labelled CV_DAC_SCK]
CV_DAC_CS: P3.14 ; off-sheet CV_DAC_CS
CV_IN_BIAS: P2.45 ; off-sheet CV_IN_BIAS
CV_IN_DET: P2.47 ; off-sheet CV_IN_DET
CV_OUT_BIAS: P3.10 ; off-sheet CV_OUT_BIAS
EXP_EN1: P3.38 ; off-sheet EXP_EN1
EXP_EN2: P3.32 ; off-sheet EXP_EN2
EXP_FLAG1: P3.36 ; off-sheet EXP_FLAG1
EXP_FLAG2: P3.34 ; off-sheet EXP_FLAG2
HMI_ISP_ENABLE: P2.35 ; off-sheet HMI_ISP_ENABLE  [project net ETH1_LED3]
HMI_ISP_RESET: P2.37 ; off-sheet HMI_ISP_RESET  [project net ETH1_MDI3N]
HMI_ISP_UART_RX: P2.41 ; off-sheet HMI_ISP_UART_RX
HMI_ISP_UART_TX: P2.39 ; off-sheet HMI_ISP_UART_TX
HMI_RFU_UART_RX: P2.21 ; off-sheet HMI_RFU_UART_RX
HMI_RFU_UART_TX: P2.19 ; off-sheet HMI_RFU_UART_TX
HMI_SPIO_CLK: P2.29 ; off-sheet HMI_SPIO_CLK  [project net ETH1_LED1_SPD]
HMI_SPIO_CS0: P2.31 ; off-sheet HMI_SPIO_CS0  [project net ETH1_MDI2N]
HMI_SPIO_MISO: P2.25 ; off-sheet HMI_SPIO_MISO  [project net ETH1_MDI1N]
HMI_SPIO_MOSI: P2.27 ; off-sheet HMI_SPIO_MOSI  [project net ETH1_MDI1P]
HP_CLOCK: P3.2 ; off-sheet HP_CLOCK
HP_DISABLE: P3.8 ; off-sheet HP_DISABLE  [project net GPIO3_IO_9]
HP_UP/DW: P3.4 ; off-sheet HP_UP/DW
IN1_GC1: P3.35 ; off-sheet IN1_GC1  [project net GPIO3_IO_12]
IN1_GC2: P3.33 ; off-sheet IN1_GC2  [project net GPIO3_IO_13]
IN1_TBP: P3.3 ; off-sheet IN1_TBP  [project net GPIO3_IO_6]
IN2_GC1: P3.37 ; off-sheet IN2_GC1  [project net GPIO3_IO_11]
IN2_GC2: P3.39 ; off-sheet IN2_GC2  [project net GPIO3_IO_10]
IN2_TBP: P3.5 ; off-sheet IN2_TBP  [project net GPIO3_IO_7]
MIDI_UART_RX: P2.20 ; off-sheet MIDI_UART_RX  [project net ECSPI3_MISO]
MIDI_UART_TX: P2.18 ; off-sheet MIDI_UART_TX
PM_LEDS_OE: P2.7 ; off-sheet PM_LEDS_OE
PM_LEDS_SCL: P2.5 ; off-sheet PM_LEDS_SCL  [project net I2C1_SCL]
PM_LEDS_SDA: P2.3 ; off-sheet PM_LEDS_SDA  [project net I2C1_SDA]
PWR_BUTTON: P2.9 ; off-sheet PWR_BUTTON  [project net COLD_RESET_IN]
UBOOT_BUTTON: P2.14 ; off-sheet UBOOT_BUTTON  [project net ALT_BOOT]
USB_DEV_DET: P2.24 ; off-sheet USB_DEV_DET  [project net USB2_VBUS_DET]
USB_DEV_DM: P2.26 ; off-sheet USB_DEV_DM  [project net USB2D_N]
USB_DEV_DP: P2.28 ; off-sheet USB_DEV_DP  [project net USB2D_P]
USB_HOST_DM: P2.42 ; off-sheet USB_HOST_DM  [project net USB1D_N]
USB_HOST_DP: P2.44 ; off-sheet USB_HOST_DP  [project net USB1D_P]
USB_HOST_DRV: P2.48 ; off-sheet USB_HOST_DRV  [project net GPIO3_IO_21]

Not connected (* = marked no-connect by the designer): P2 1* 2* 4* 6* 8* 10* 12* 32* 34* 38* 40*

### Library data of the parts
P2 = DF12(3.0)-60DS-0.5V(86): CONN RECEPT 60POS 3MM SMD 0.5MM; Manufacturer 1: Hirose; Number of Contacts: 60; Current Rating: 300mA; Voltage Rating: 50V; Gender: Receptacle; Contact Resistance: 50mR; Mating Cycles: 50; Insulation Resistance: 500MR; Row Spacing: 2.4mm; Supplier 1: Digi-Key; Manufacturer Part Number 1: DF12(3.0)-60DS-0.5V(86); Stock 1: 7229; Pricing 1: 1=1.87, 10=1.698, 25=1.594, 50=1.5246, 100=1.4553, 250=1.31672, 500=1.21276 (USD); Mount: Surface Mount; Contact Plating: Gold; Contact Material: Copper,Copper Alloy; Housing Colour: Beige; Housing Material: Polyamide; Insulation Material: Nylon; Colour: Beige; Min Operating Temperature: -45°C; Max Operating Temperature: 125°C; Number of Rows: 2; Termination: Solder; Packaging: Tape and Reel; Package Quantity: 1; Number of Positions: 60; Orientation: Straight; Max Current Rating: 300mA; Max Voltage Rating (AC): 50V; Voltage Rating (AC): 50V; Connector Type: Receptacle; Length: 18mm; Pitch: 0.5mm; Stack Height: 3mm; Mated Stacking Heights: 3mm; Depth: 3.6mm; Lead Pitch: 0.5mm; Width: 18mm; Radiation Hardening: No; Flammability Rating: UL94 V-0; REACH SVHC: No SVHC; Lead Free: Lead Free; Supplier Part Number 1: H5207CT-ND
P3 = DF12(3.0)-40DS-0.5V(86): CONN RECEPT 40POS 3MM SMD 0.5MM; Manufacturer 1: Hirose; Number of Contacts: 40; Current Rating: 300mA; Voltage Rating: 50V; Gender: Receptacle; Contact Resistance: 50mR; Row Spacing: 2.4mm; Supplier 1: Digi-Key; Manufacturer Part Number 1: DF12(3.0)-40DS-0.5V(86); Stock 1: 9904; Pricing 1: 1=1.44, 10=1.262, 25=1.188, 50=1.1386, 100=1.089, 250=0.99, 500=0.891 (USD); Mount: Surface Mount; Contact Plating: Gold; Contact Material: Copper; Housing Colour: Beige; Housing Material: Polyamide; Insulation Material: Nylon; Min Operating Temperature: -45°C; Max Operating Temperature: 125°C; Number of Rows: 2; Termination: SMD/SMT; Packaging: Tape and Reel; Package Quantity: 1000; Number of Positions: 40; Orientation: Straight; Connector Type: Receptacle; Max Current Rating: 300mA; Max Voltage Rating (AC): 50V; Length: 13mm; Pitch: 0.5mm; Mated Stacking Heights: 3mm; Stack Height: 3mm; Depth: 3.6mm; Radiation Hardening: No; Lead Free: Lead Free; Flammability Rating: UL94 V-0; REACH SVHC: No SVHC; Supplier Part Number 1: H11706CT-ND

## Sheet [3]-DCDC-4V2.SchDoc: [3]-DCDC-4V2
size A3; DocumentNumber: NA; Revision: 2019.01.18; SheetNumber: 3; SheetTotal: 3
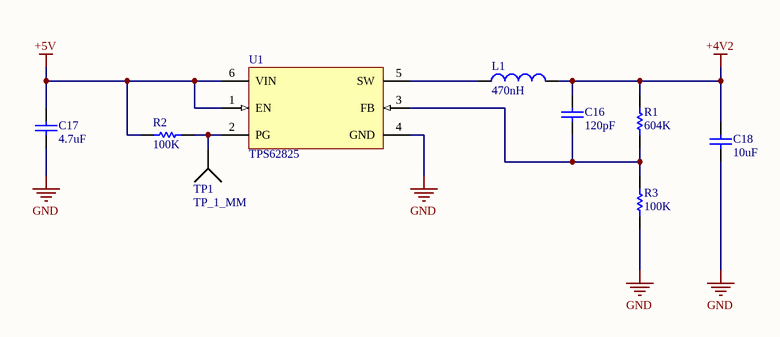
[diagram p2: [3]-DCDC-4V2.SchDoc]

### Parts
C16  120pF  [CAPC1005N]
C17  4.7uF  [CAPC2012N]
C18  10uF  [CAPC2012N]
L1  470nH  [IHLP-1212AE-11]
R1  604K  [RESC1005N]
R2  100K  [RESC1005N]
R3  100K  [RESC1005N]
TP1  TP_1_MM  [TP_1_MM]  (no BOM)
U1  TPS62825  [DMQ0006A]

### Nets
+4V2: C16.2 C18.2 L1.2 R1.2
+5V: C17.2 R2.1 U1.1(EN) U1.6(VIN)
GND: C17.1 C18.1 R3.1 U1.4(GND)
NetC16_1: C16.1 R1.1 R3.2 U1.3(FB)
NetL1_1: L1.1 U1.5(SW)
NetR2_2: R2.2 TP1.1 U1.2(PG)

### Library data of the parts
C16 = GRM1555C1H121FA01D: CAP CER 120PF 50V C0G/NP0 0402; Manufacturer 1: Murata; Description 1: Multilayer Ceramic Capacitors MLCC - SMD/SMT 0402 120pF 50volts 1%; Brand: Murata Electronics; Tolerance: 1 %; Dielectric: C0G (NP0); Case Height: 0.5 mm; Case Length: 1 mm; Temperature Coefficient / Code: +/- 30 PPM / C; Type: General Purpose MLCC; Material: Ceramic; Temperature Coefficient: 30ppm/°C; Supplier 1: Digi-Key; Stock 1: 154558; Pricing 1: 1=0.15, 10=0.107, 100=0.0501, 500=0.0351, 1000=0.0291, 2500=0.0271, 5000=0.0248 (USD); Voltage Rating: 50 V; Product Category: Multilayer Ceramic Capacitors MLCC - SMD/SMT; RoHS: Details; Capacitance: 120 pF; Voltage Rating DC: 50 V; Case Code - in: 0402; Case Code - mm: 1005; Minimum Operating Temperature: - 55 C; Maximum Operating Temperature: + 125 C; Product: General Type MLCCs; Case Width: 0.5 mm; Operating Temperature Range: - 55 C to + 125 C; Package / Case: 0402 (1005 metric); Packaging: Reel; Series: GRM; Factory Pack Quantity: 10000; Termination Style: SMD/SMT; Dimensions: 0.5 mm W x 1 mm L x 0.5 mm H; ComponentLink1URL: https://datasheet.ciiva.com/11617/c02e-11617455.pdf; ComponentLink1Description: https://datasheet.ciiva.com/11617/c02e-11617455.pdf; ComponentLink2URL: https://datasheet.ciiva.com/17451/c02e-17451502.pdf; ComponentLink2Description: https://datasheet.ciiva.com/17451/c02e-17451502.pdf; Supplier Part Number 1: 490-8182-1-ND; Supplier 2: Digi-Key; Manufacturer 2: Murata; Manufacturer Part Number 2: GRM1555C1H121JA01D; Stock 2: 100000; Pricing 2: 1=0.1, 10=0.065, 100=0.0289, 500=0.02066, 1000=0.01623, 2500=0.01475, 5000=0.01357 (USD); Mount: Surface Mount; Case/Package: 0402; Case Code (Imperial): 0402; Case Code (Metric): 1005; Min Operating Temperature: -55°C; Max Operating Temperature: 125°C; Voltage Rating (DC): 50V; Package Quantity: 1; Termination: SMD/SMT; Voltage: 50V; Length: 1mm; Height: 0.5mm; Width: 0.5mm; Thickness: 0.022inch; Depth: 0.5mm; Radiation Hardening: No; REACH SVHC: No SVHC; Lead Free: Lead Free; Manufacturer Part Number 1: GRM1555C1H121FA01D; Supplier Part Number 2: 490-1292-1-ND
C17 = C2012X5R1E475K125AB: CAP CER 4.7UF 25V X5R 0805; Manufacturer 1: TDK; Dielectric Material: Ceramic; Tolerance: 10%; Supplier 1: Digi-Key; Manufacturer Part Number 1: C2012X5R1E475K125AB; Stock 1: 20000; Pricing 1: 1=0.38, 10=0.259, 100=0.1466, 500=0.1035, 1000=0.09056 (USD); Mount: Surface Mount; Case/Package: 0805; Number of Pins: 2; Weight: 0.000194oz; Case Code (Imperial): 0805; Case Code (Metric): 2012; Min Operating Temperature: -55°C; Max Operating Temperature: 85°C; Capacitance: 4.7uF; Dielectric: X5R; Voltage Rating: 25V; Voltage Rating (DC): 25V; Packaging: Tape and Reel; Package Quantity: 1; Termination: SMD/SMT; Composition: Ceramic; Voltage: 25V; Length: 2mm; Height: 1.25mm; Depth: 1.25mm; Width: 1.25mm; Thickness: 0.057inch; Radiation Hardening: No; REACH SVHC: No SVHC; Lead Free: Lead Free; ComponentLink1URL: https://datasheet.ciiva.com/24216/tdkmlcccaprange-24216480.pdf; ComponentLink1Description: https://datasheet.ciiva.com/24216/tdkmlcccaprange-24216480.pdf; ComponentLink2URL: https://datasheet.ciiva.com/11788/0900766b80c1bb00-11788107.pdf; ComponentLink2Description: https://datasheet.ciiva.com/11788/0900766b80c1bb00-11788107.pdf; ComponentLink3URL: https://datasheet.ciiva.com/36857/1796654-36857301.pdf; ComponentLink3Description: https://datasheet.ciiva.com/36857/1796654-36857301.pdf; ComponentLink4URL: https://datasheet.ciiva.com/22773/1571323-22773430.pdf; ComponentLink4Description: https://datasheet.ciiva.com/22773/1571323-22773430.pdf; ComponentLink5URL: https://datasheet.ciiva.com/6251/tdkmlcccaprange-6251817.pdf; ComponentLink5Description: https://datasheet.ciiva.com/6251/tdkmlcccaprange-6251817.pdf; ComponentLink6URL: https://datasheet.ciiva.com/22676/1571323-22676937.pdf; ComponentLink6Description: https://datasheet.ciiva.com/22676/1571323-22676937.pdf; ComponentLink7URL: https://datasheet.ciiva.com/6251/tdkmlcccaprange-6251820.pdf; ComponentLink7Description: https://datasheet.ciiva.com/6251/tdkmlcccaprange-6251820.pdf; ComponentLink8URL: https://datasheet.ciiva.com/28602/1744655-28602173.pdf; ComponentLink8Description: https://datasheet.ciiva.com/28602/1744655-28602173.pdf; ComponentLink9URL: https://datasheet.ciiva.com/6251/tdkmlcccaprange-6251823.pdf; ComponentLink9Description: https://datasheet.ciiva.com/6251/tdkmlcccaprange-6251823.pdf; ComponentLink10URL: https://datasheet.ciiva.com/16449/e412-c-16449599.pdf; ComponentLink10Description: https://datasheet.ciiva.com/16449/e412-c-16449599.pdf; Supplier Part Number 1: 445-4116-1-ND
C18 = C2012X7R1A106K125AC: as C12 on sheet [1]-SODIMM-COL-SOM-iMX8; Supplier 1: Digi-Key; Manufacturer Part Number 1: C2012X7R1A106K125AC; Stock 1: 20000; Pricing 1: 1=0.52, 10=0.359, 100=0.2156, 500=0.16172, 1000=0.13656 (USD); Mount: Surface Mount; Case/Package: 0805; Number of Pins: 2; Weight: 0.000194oz; Case Code (Metric): 2012; Case Code (Imperial): 0805; Contact Plating: Matte,Tin; Min Operating Temperature: -55°C; Max Operating Temperature: 125°C; Capacitance: 10uF; Dielectric: X7R; Voltage Rating: 10V; Packaging: Tape and Reel; Voltage Rating (DC): 10V; Termination: SMD/SMT; Package Quantity: 1; Composition: Ceramic; Voltage: 10V; Length: 2mm; Height: 1.25mm; Width: 0.049inch; Depth: 1.25mm; Thickness: 0.057inch; Radiation Hardening: No; Lead Free: Lead Free; REACH SVHC: No SVHC; Supplier Part Number 1: 445-6857-1-ND
L1 = IHLP1212AEERR47M11: FIXED IND 470NH 6.7A 15 MOHM SMD; Manufacturer 1: Vishay Dale; Core Material: Ferrite; Tolerance: 20%; Self Resonant Frequency: 1MHz; Shielding: Shielded; DC Resistance (DCR): 15mR; Test Frequency: 100kHz; Supplier 1: Digi-Key; Manufacturer Part Number 1: IHLP1212AEERR47M11; Stock 1: 27366; Pricing 1: 1=1.41, 10=1.308, 100=0.9459, 500=0.7245, 1000=0.644 (USD); Mount: Surface Mount; Case/Package: 1212; Number of Pins: 2; Min Operating Temperature: -55°C; Max Operating Temperature: 125°C; Packaging: Tape and Reel; Inductance Tolerance: 20%; Package Quantity: 3000; Current Rating: 6.7A; Saturation Current: 6.7A; Inductance: 470nh; Max DC Current: 6.7A; Termination: SMD/SMT; RMS Current (Irms): 6.7A; Military Standard: Not; Length: 3.6mm; Height: 1.2mm; Width: 3mm; Height - Seated (Max): 0.059inch; Depth: 3.2mm; Radiation Hardening: No; REACH SVHC: Unknown; Lead Free: Lead Free; Supplier Part Number 1: 541-1330-1-ND
R1 = RC0402FR-07604KL: RES SMD 604K OHM 1% 1/16W 0402; Manufacturer 1: Yageo; Resistance: 604kR; Temperature Coefficient: 100ppm/°C; Power Rating: 62.5mW; Voltage Rating: 50V; Max Power Dissipation: 63mW; Supplier 1: Digi-Key; Manufacturer Part Number 1: RC0402FR-07604KL; Stock 1: 119604; Pricing 1: 1=0.1, 10=0.022, 100=0.009, 1000=0.00402, 2500=0.00349, 5000=0.00288 (USD); Case/Package: 0402; Contact Plating: Lead,Matte,Tin; Case Code (Imperial): 0402; Case Code (Metric): 1005; Min Operating Temperature: -55°C; Max Operating Temperature: 155°C; Tolerance: 1%; Composition: Thick Film; Packaging: Tape and Reel; Termination: SMD/SMT; Number of Terminations: 2; Military Standard: Not; Voltage Rating (DC): 50V; Working Voltage: 50V; Features: Moisture Resistant; Length: 0.039inch; Height: 0.016inch; Width: 0.02inch; Depth: 0.5mm; Radiation Hardening: No; Lead Free: Lead Free; Supplier Part Number 1: YAG3198CT-ND
R2 R3 = RC0402FR-07100KL: as R5 on sheet [1]-SODIMM-COL-SOM-iMX8; Supplier 1: Digi-Key; Manufacturer Part Number 1: RC0402FR-07100KL; Description 1: RES SMD 100K OHM 1% 1/16W 0402; Stock 1: 10691398; Pricing 1: 1=0.1, 10=0.014, 100=0.0056, 1000=0.0025, 2500=0.0022, 5000=0.0018 (USD); Termination Style: SMD/SMT; Product: Thick Film Resistors General Purpose; Tolerance: 1 %; Case Code - in: 0402; Case Code - mm: 1005; Series: RC; Operating Temperature Range: - 55 C to + 155 C; Packaging: Reel; ComponentLink1URL: https://datasheet.ciiva.com/11819/0900766b80c66297-11819452.pdf; ComponentLink1Description: https://datasheet.ciiva.com/11819/0900766b80c66297-11819452.pdf; ComponentLink2URL: https://datasheet.ciiva.com/16740/pyu-rc0402-51-rohs-l-6-r-16740567.pdf; ComponentLink2Description: https://datasheet.ciiva.com/16740/pyu-rc0402-51-rohs-l-6-r-16740567.pdf; ComponentLink3URL: https://datasheet.ciiva.com/12667/pyu-rc0402-51-rohs-l-6-r-12667930.pdf; ComponentLink3Description: https://datasheet.ciiva.com/12667/pyu-rc0402-51-rohs-l-6-r-12667930.pdf; ComponentLink4URL: https://datasheet.ciiva.com/2453/pyu-r-int-thick-7-2453361.pdf; ComponentLink4Description: https://datasheet.ciiva.com/2453/pyu-r-int-thick-7-2453361.pdf; ComponentLink5URL: https://datasheet.ciiva.com/15189/getdatasheetpartid-323696-15189334.pdf; ComponentLink5Description: https://datasheet.ciiva.com/15189/getdatasheetpartid-323696-15189334.pdf; ComponentLink6URL: https://datasheet.ciiva.com/2453/pyu-r-int-thick-7-2453362.pdf; ComponentLink6Description: https://datasheet.ciiva.com/2453/pyu-r-int-thick-7-2453362.pdf; ComponentLink7URL: https://datasheet.ciiva.com/2453/pyu-r-int-thick-7-2453363.pdf; ComponentLink7Description: https://datasheet.ciiva.com/2453/pyu-r-int-thick-7-2453363.pdf; ComponentLink8URL: https://datasheet.ciiva.com/22747/1018594-22747509.pdf; ComponentLink8Description: https://datasheet.ciiva.com/22747/1018594-22747509.pdf; Supplier Part Number 1: 311-100KLRCT-ND
U1 = IC_TPS62825DMQR: IC STEP DOWN CONV 1-5V 2A QFN; Manufacturer 1: Texas Instruments; Supplier 1: Digi-Key; Manufacturer Part Number 1: TPS62825DMQR; Stock 1: 1427; Pricing 1: 1=1.56, 10=1.392, 100=1.085, 500=0.8963, 1000=0.70761 (USD); Supplier Part Number 1: 296-49521-1-ND

## Nets that join several sheets
+4V2: [1]-SODIMM-COL-SOM-iMX8 (27 pins), [3]-DCDC-4V2 (C16.2 C18.2 L1.2 R1.2)
+5V: [1]-SODIMM-COL-SOM-iMX8 (C20.2 R4.2 R5.2), [2]-INTERFACE_CONNS (P2.53 P2.55 P2.57 P2.59), [3]-DCDC-4V2 (C17.2 R2.1 U1.1 U1.6)
GND: [1]-SODIMM-COL-SOM-iMX8 (31 pins), [2]-INTERFACE_CONNS (23 pins), [3]-DCDC-4V2 (C17.1 C18.1 R3.1 U1.4)
ALT_BOOT: [1]-SODIMM-COL-SOM-iMX8 (P1.185), [2]-INTERFACE_CONNS (P2.14)
CHAIN_UART_DE: [1]-SODIMM-COL-SOM-iMX8 (P1.75), [2]-INTERFACE_CONNS (P2.56)
CHAIN_UART_RE: [1]-SODIMM-COL-SOM-iMX8 (P1.73), [2]-INTERFACE_CONNS (P2.52)
CHAIN_UART_RX: [1]-SODIMM-COL-SOM-iMX8 (P1.69), [2]-INTERFACE_CONNS (P2.54)
CHAIN_UART_TX: [1]-SODIMM-COL-SOM-iMX8 (P1.65), [2]-INTERFACE_CONNS (P2.58)
CLI_UART_RX: [1]-SODIMM-COL-SOM-iMX8 (P1.117), [2]-INTERFACE_CONNS (P2.13)
CLI_UART_TX: [1]-SODIMM-COL-SOM-iMX8 (P1.111), [2]-INTERFACE_CONNS (P2.15)
CODEC_I2C_SCL: [1]-SODIMM-COL-SOM-iMX8 (P1.43), [2]-INTERFACE_CONNS (P3.11)
CODEC_I2C_SDA: [1]-SODIMM-COL-SOM-iMX8 (P1.49), [2]-INTERFACE_CONNS (P3.13)
CODEC_I2S_BCLK: [1]-SODIMM-COL-SOM-iMX8 (P1.112), [2]-INTERFACE_CONNS (P3.19)
CODEC_I2S_LRCK: [1]-SODIMM-COL-SOM-iMX8 (P1.110), [2]-INTERFACE_CONNS (P3.17)
CODEC_I2S_MCLK: [1]-SODIMM-COL-SOM-iMX8 (P1.108), [2]-INTERFACE_CONNS (P3.15)
CODEC_I2S_SDIN: [1]-SODIMM-COL-SOM-iMX8 (P1.144), [2]-INTERFACE_CONNS (P3.25)
CODEC_I2S_SDOUT: [1]-SODIMM-COL-SOM-iMX8 (P1.134), [2]-INTERFACE_CONNS (P3.23)
CODEC_I2S_SPDIF_SDIN: [1]-SODIMM-COL-SOM-iMX8 (P1.196), [2]-INTERFACE_CONNS (P3.27)
CODEC_MUTEC: [1]-SODIMM-COL-SOM-iMX8 (P1.192), [2]-INTERFACE_CONNS (P3.29)
CODEC_RESET: [1]-SODIMM-COL-SOM-iMX8 (P1.52), [2]-INTERFACE_CONNS (P3.9)
COLD_RESET_IN: [1]-SODIMM-COL-SOM-iMX8 (P1.165 P1.171), [2]-INTERFACE_CONNS (P2.9)
CV_ADC_CS: [1]-SODIMM-COL-SOM-iMX8 (P1.17), [2]-INTERFACE_CONNS (P3.28)
CV_ADC_DIN: [1]-SODIMM-COL-SOM-iMX8 (P1.11), [2]-INTERFACE_CONNS (P3.16 P3.22)
CV_ADC_DOUT: [1]-SODIMM-COL-SOM-iMX8 (P1.15), [2]-INTERFACE_CONNS (P3.24)
CV_ADC_SCLK: [1]-SODIMM-COL-SOM-iMX8 (P1.13), [2]-INTERFACE_CONNS (P3.18 P3.26)
CV_DAC_CS: [1]-SODIMM-COL-SOM-iMX8 (P1.9), [2]-INTERFACE_CONNS (P3.14)
CV_IN_BIAS: [1]-SODIMM-COL-SOM-iMX8 (P1.4), [2]-INTERFACE_CONNS (P2.45)
CV_IN_DET: [1]-SODIMM-COL-SOM-iMX8 (P1.6), [2]-INTERFACE_CONNS (P2.47)
CV_OUT_BIAS: [1]-SODIMM-COL-SOM-iMX8 (P1.92), [2]-INTERFACE_CONNS (P3.10)
ECSPI3_MISO: [1]-SODIMM-COL-SOM-iMX8 (P1.63), [2]-INTERFACE_CONNS (P2.20)
ETH1_LED1_SPD: [1]-SODIMM-COL-SOM-iMX8 (P1.16), [2]-INTERFACE_CONNS (P2.29)
ETH1_LED3: [1]-SODIMM-COL-SOM-iMX8 (P1.22), [2]-INTERFACE_CONNS (P2.35)
ETH1_MDI1N: [1]-SODIMM-COL-SOM-iMX8 (P1.12), [2]-INTERFACE_CONNS (P2.25)
ETH1_MDI1P: [1]-SODIMM-COL-SOM-iMX8 (P1.14), [2]-INTERFACE_CONNS (P2.27)
ETH1_MDI2N: [1]-SODIMM-COL-SOM-iMX8 (P1.18), [2]-INTERFACE_CONNS (P2.31)
ETH1_MDI3N: [1]-SODIMM-COL-SOM-iMX8 (P1.24), [2]-INTERFACE_CONNS (P2.37)
EXP_EN1: [1]-SODIMM-COL-SOM-iMX8 (P1.203), [2]-INTERFACE_CONNS (P3.38)
EXP_EN2: [1]-SODIMM-COL-SOM-iMX8 (P1.197), [2]-INTERFACE_CONNS (P3.32)
EXP_FLAG1: [1]-SODIMM-COL-SOM-iMX8 (P1.201), [2]-INTERFACE_CONNS (P3.36)
EXP_FLAG2: [1]-SODIMM-COL-SOM-iMX8 (P1.199), [2]-INTERFACE_CONNS (P3.34)
GPIO3_IO_6: [1]-SODIMM-COL-SOM-iMX8 (P1.74), [2]-INTERFACE_CONNS (P3.3)
GPIO3_IO_7: [1]-SODIMM-COL-SOM-iMX8 (P1.76), [2]-INTERFACE_CONNS (P3.5)
GPIO3_IO_9: [1]-SODIMM-COL-SOM-iMX8 (P1.94), [2]-INTERFACE_CONNS (P3.8)
GPIO3_IO_10: [1]-SODIMM-COL-SOM-iMX8 (P1.155), [2]-INTERFACE_CONNS (P3.39)
GPIO3_IO_11: [1]-SODIMM-COL-SOM-iMX8 (P1.153), [2]-INTERFACE_CONNS (P3.37)
GPIO3_IO_12: [1]-SODIMM-COL-SOM-iMX8 (P1.151), [2]-INTERFACE_CONNS (P3.35)
GPIO3_IO_13: [1]-SODIMM-COL-SOM-iMX8 (P1.149), [2]-INTERFACE_CONNS (P3.33)
GPIO3_IO_21: [1]-SODIMM-COL-SOM-iMX8 (P1.148), [2]-INTERFACE_CONNS (P2.48)
HMI_ISP_UART_RX: [1]-SODIMM-COL-SOM-iMX8 (P1.5), [2]-INTERFACE_CONNS (P2.41)
HMI_ISP_UART_TX: [1]-SODIMM-COL-SOM-iMX8 (P1.3), [2]-INTERFACE_CONNS (P2.39)
HMI_RFU_UART_RX: [1]-SODIMM-COL-SOM-iMX8 (P1.118), [2]-INTERFACE_CONNS (P2.21)
HMI_RFU_UART_TX: [1]-SODIMM-COL-SOM-iMX8 (P1.116), [2]-INTERFACE_CONNS (P2.19)
HP_CLOCK: [1]-SODIMM-COL-SOM-iMX8 (P1.82), [2]-INTERFACE_CONNS (P3.2)
HP_UP/DW: [1]-SODIMM-COL-SOM-iMX8 (P1.80), [2]-INTERFACE_CONNS (P3.4)
I2C1_SCL: [1]-SODIMM-COL-SOM-iMX8 (P1.129), [2]-INTERFACE_CONNS (P2.5)
I2C1_SDA: [1]-SODIMM-COL-SOM-iMX8 (P1.135), [2]-INTERFACE_CONNS (P2.3)
MIDI_UART_TX: [1]-SODIMM-COL-SOM-iMX8 (P1.58), [2]-INTERFACE_CONNS (P2.18)
PM_LEDS_OE: [1]-SODIMM-COL-SOM-iMX8 (P1.128), [2]-INTERFACE_CONNS (P2.7)
USB1D_N: [1]-SODIMM-COL-SOM-iMX8 (P1.178), [2]-INTERFACE_CONNS (P2.42)
USB1D_P: [1]-SODIMM-COL-SOM-iMX8 (P1.176), [2]-INTERFACE_CONNS (P2.44)
USB2_VBUS_DET: [1]-SODIMM-COL-SOM-iMX8 (P1.156 R4.1), [2]-INTERFACE_CONNS (P2.24)
USB2D_N: [1]-SODIMM-COL-SOM-iMX8 (P1.170), [2]-INTERFACE_CONNS (P2.26)
USB2D_P: [1]-SODIMM-COL-SOM-iMX8 (P1.172), [2]-INTERFACE_CONNS (P2.28)

## Assembly variants
NO_VUSB2: not fitted C20 R4